# Altium schematic sheet v6_io_23_24_25_26.SchDoc: Virtex-6 IO Banks 23, 24, 25 & 26
size A3; Date: DO NOT USE, RATHER USE PROJ OPTIONS; DrawnBy: DO NOT USE, RATHER USE PROJ OPTIONS; Engineer: DO NOT USE, RATHER USE PROJ OPTIONS; Organization: DO NOT USE, RATHER USE PROJ OPTIONS; DocumentNumber: DO NOT USE, RATHER USE PROJ OPTIONS; Revision: DO NOT USE, RATHER USE PROJ OPTIONS; SheetNumber: 15; SheetTotal: 27; SCH_Sheet_Filename: v6_config_io_23_24_25_26.SchDoc; CurrentTime: DO NOT USE, RATHER USE PROJ OPTIONS; Time: DO NOT USE, RATHER USE PROJ OPTIONS; DocumentFullPathAndName: DO NOT USE, RATHER USE PROJ OPTIONS; DocumentName: DO NOT USE, RATHER USE PROJ OPTIONS; ModifiedDate: DO NOT USE, RATHER USE PROJ OPTIONS; ImagePath: DO NOT USE, RATHER USE PROJ OPTIONS
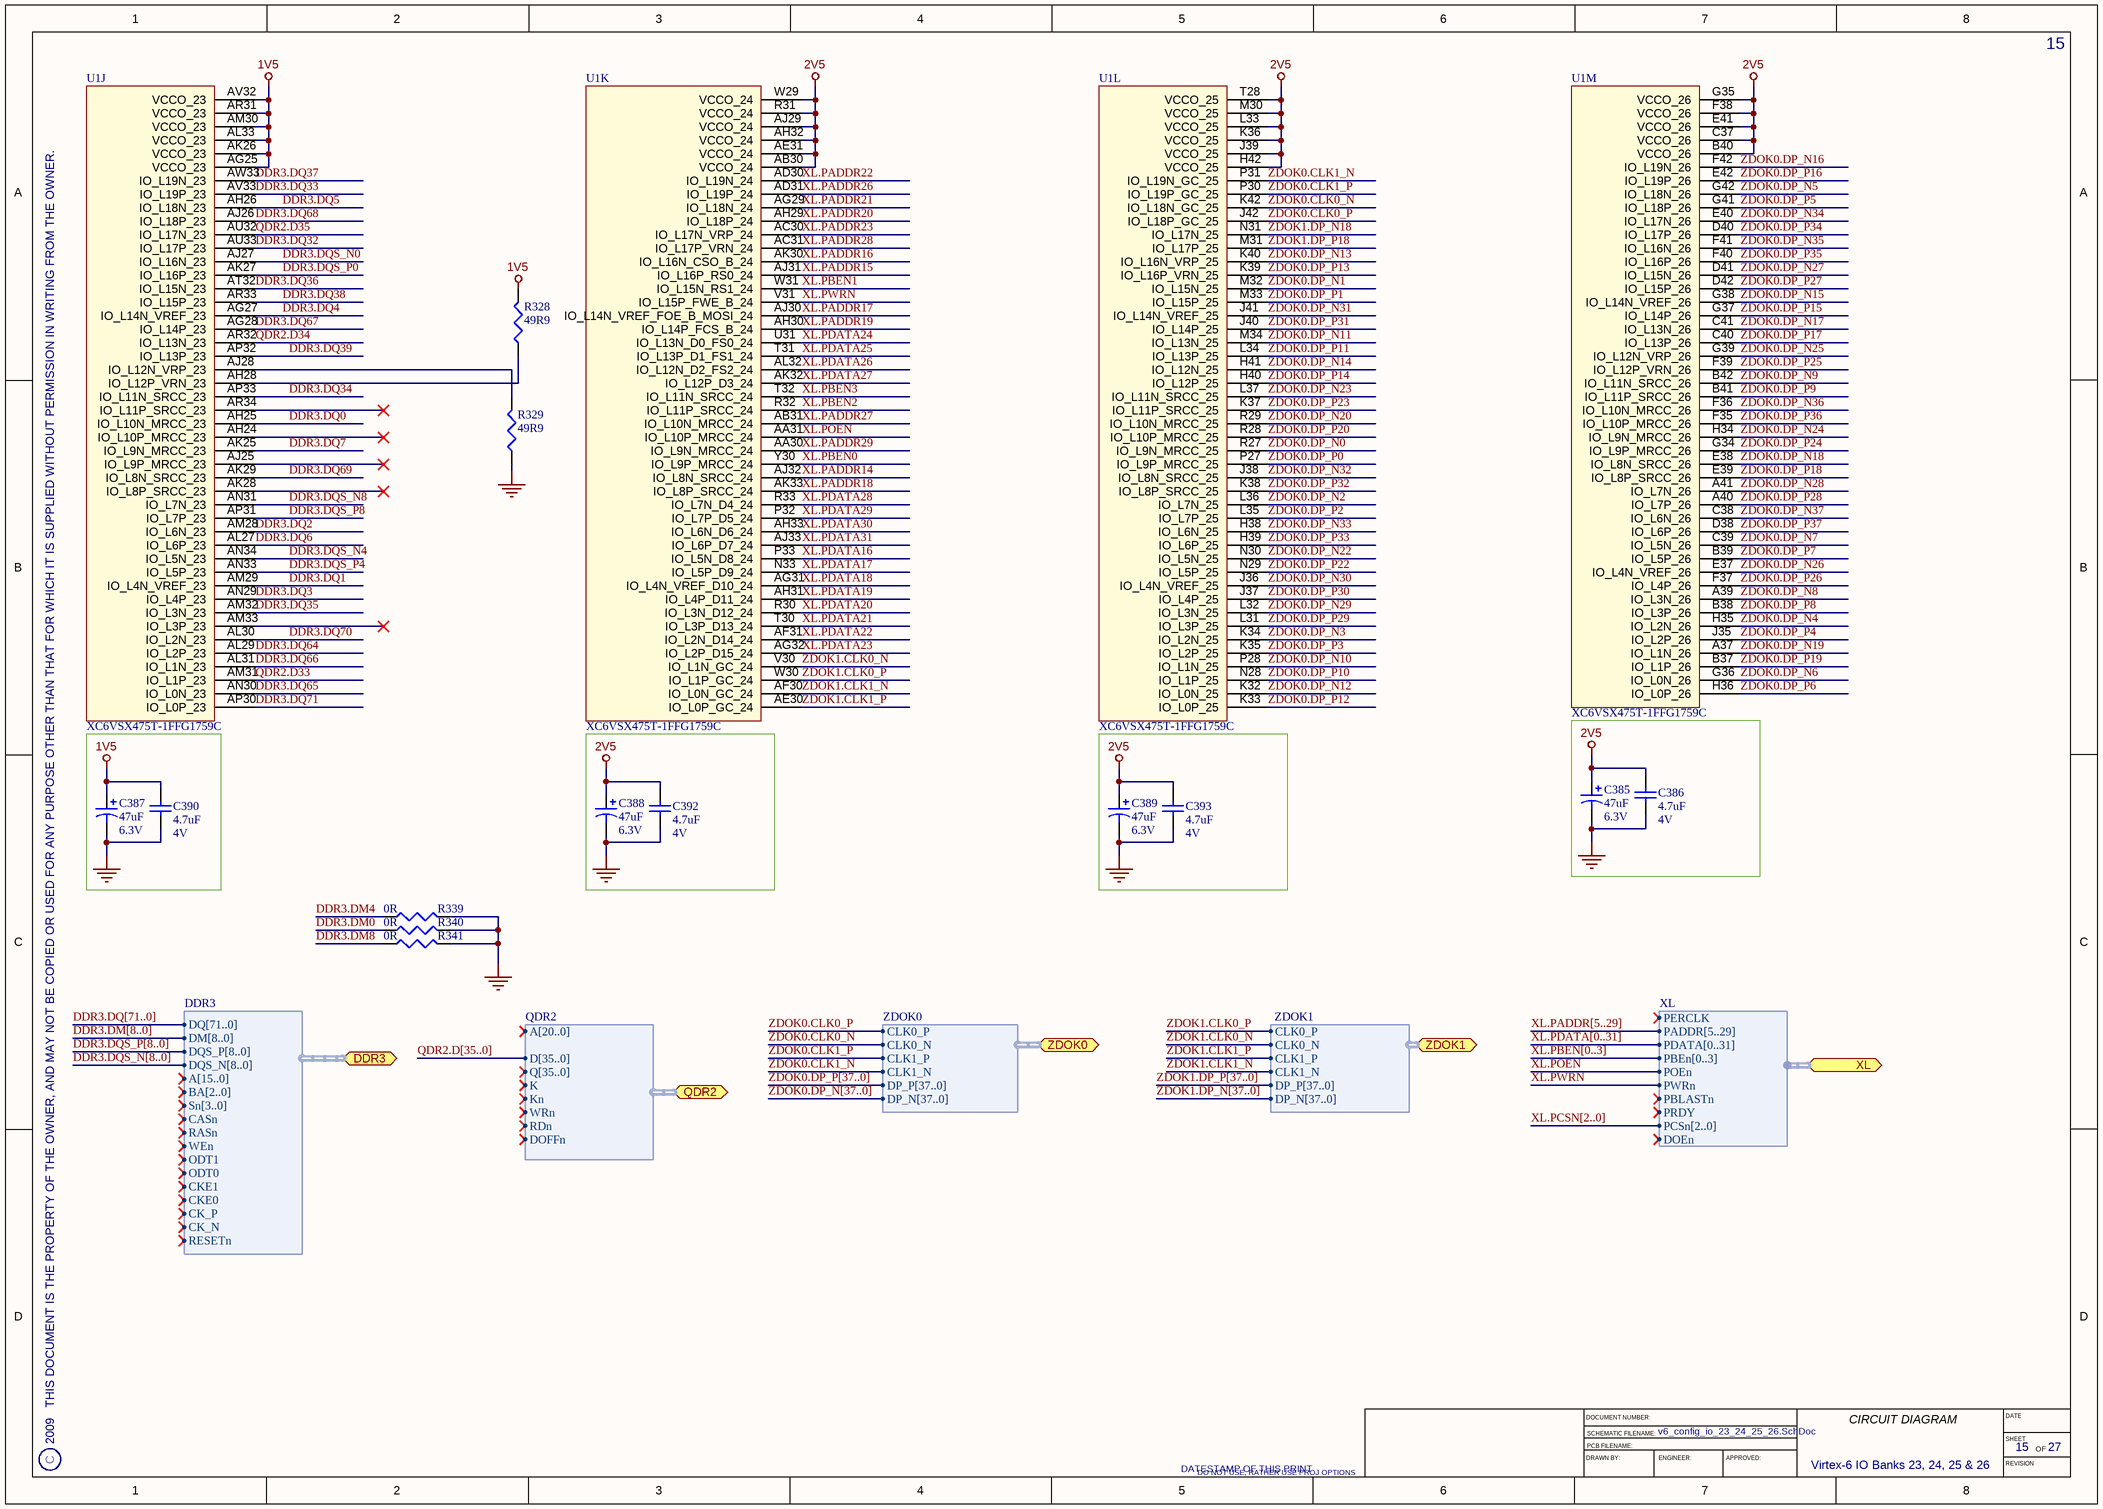
[diagram p0: v6_io_23_24_25_26.SchDoc]

## Parts
C385  Rating: 6.3V  [CAPMP3528X120L]  (hidden comment: 47uF)
C386  Rating: 4V  [CAPC1005X60L]  (hidden comment: 4.7uF)
C387  Rating: 6.3V  [CAPMP3528X120L]  (hidden comment: 47uF)
C388  Rating: 6.3V  [CAPMP3528X120L]  (hidden comment: 47uF)
C389  Rating: 6.3V  [CAPMP3528X120L]  (hidden comment: 47uF)
C390  Rating: 4V  [CAPC1005X60L]  (hidden comment: 4.7uF)
C392  Rating: 4V  [CAPC1005X60L]  (hidden comment: 4.7uF)
C393  Rating: 4V  [CAPC1005X60L]  (hidden comment: 4.7uF)
R328  49R9  [RESC1005X40L]
R329  49R9  [RESC1005X40L]
R339  0R  [RESC1005X40L]
R340  0R  [RESC1005X40L]
R341  0R  [RESC1005X40L]
U1  XC6VSX475T-1FFG1759C  [FFG1759]  (parts J,K,L,M of 39)

## Ports
DDR3 (harness DDR3), QDR2 (harness QDR2), XL (harness XL), ZDOK0 (harness ZDOK0), ZDOK1 (harness ZDOK1)

## Harnesses
ZDOK1: CLK0_P, CLK0_N, CLK1_P, CLK1_N, DP_P[37..0], DP_N[37..0]
QDR2: A[20..0], D[35..0], Q[35..0], K, Kn, WRn, RDn, DOFFn
DDR3: DQ[71..0], DM[8..0], DQS_P[8..0], DQS_N[8..0], A[15..0], BA[2..0], Sn[3..0], CASn, RASn, WEn, ODT1, ODT0, CKE1, CKE0, CK_P, CK_N, RESETn
ZDOK0: CLK0_P, CLK0_N, CLK1_P, CLK1_N, DP_P[37..0], DP_N[37..0]
XL: PERCLK, PADDR[5..29], PDATA[0..31], PBEn[0..3], POEn, PWRn, PBLASTn, PRDY, PCSn[2..0], DOEn

## Nets
1V5: C387.1 C390.2 R328.2 U1.AG25(VCCO_23) U1.AK26(VCCO_23) U1.AL33(VCCO_23) U1.AM30(VCCO_23) U1.AR31(VCCO_23) U1.AV32(VCCO_23)
2V5: C385.1 C386.2 C388.1 C389.1 C392.2 C393.2 U1.AB30(VCCO_24) U1.AE31(VCCO_24) U1.AH32(VCCO_24) U1.AJ29(VCCO_24) U1.B40(VCCO_26) U1.C37(VCCO_26) U1.E41(VCCO_26) U1.F38(VCCO_26) U1.G35(VCCO_26) U1.H42(VCCO_25) U1.J39(VCCO_25) U1.K36(VCCO_25) U1.L33(VCCO_25) U1.M30(VCCO_25) U1.R31(VCCO_24) U1.T28(VCCO_25) U1.W29(VCCO_24)
GND: C385.2 C386.1 C387.2 C388.2 C389.2 C390.1 C392.1 C393.1 R329.1 R339.2 R340.2 R341.2
DDR3.DM0: R340.1
DDR3.DM4: R339.1
DDR3.DM8: R341.1
DDR3.DQ0: U1.AH25(IO_L10N_MRCC_23)
DDR3.DQ1: U1.AM29(IO_L4N_VREF_23)
DDR3.DQ2: U1.AM28(IO_L6N_23)
DDR3.DQ3: U1.AN29(IO_L4P_23)
DDR3.DQ4: U1.AG27(IO_L14N_VREF_23)
DDR3.DQ5: U1.AH26(IO_L18N_23)
DDR3.DQ6: U1.AL27(IO_L6P_23)
DDR3.DQ7: U1.AK25(IO_L9N_MRCC_23)
DDR3.DQ32: U1.AU33(IO_L17P_23)
DDR3.DQ33: U1.AV33(IO_L19P_23)
DDR3.DQ34: U1.AP33(IO_L11N_SRCC_23)
DDR3.DQ35: U1.AM32(IO_L3N_23)
DDR3.DQ36: U1.AT32(IO_L15N_23)
DDR3.DQ37: U1.AW33(IO_L19N_23)
DDR3.DQ38: U1.AR33(IO_L15P_23)
DDR3.DQ39: U1.AP32(IO_L13P_23)
DDR3.DQ64: U1.AL29(IO_L2P_23)
DDR3.DQ65: U1.AN30(IO_L0N_23)
DDR3.DQ66: U1.AL31(IO_L1N_23)
DDR3.DQ67: U1.AG28(IO_L14P_23)
DDR3.DQ68: U1.AJ26(IO_L18P_23)
DDR3.DQ69: U1.AK29(IO_L8N_SRCC_23)
DDR3.DQ70: U1.AL30(IO_L2N_23)
DDR3.DQ71: U1.AP30(IO_L0P_23)
DDR3.DQS_N0: U1.AJ27(IO_L16N_23)
DDR3.DQS_N4: U1.AN34(IO_L5N_23)
DDR3.DQS_N8: U1.AN31(IO_L7N_23)
DDR3.DQS_P0: U1.AK27(IO_L16P_23)
DDR3.DQS_P4: U1.AN33(IO_L5P_23)
DDR3.DQS_P8: U1.AP31(IO_L7P_23)
QDR2.D33: U1.AM31(IO_L1P_23)
QDR2.D34: U1.AR32(IO_L13N_23)
QDR2.D35: U1.AU32(IO_L17N_23)
XL.PADDR14: U1.AJ32(IO_L8N_SRCC_24)
XL.PADDR15: U1.AJ31(IO_L16P_RS0_24)
XL.PADDR16: U1.AK30(IO_L16N_CSO_B_24)
XL.PADDR17: U1.AJ30(IO_L14N_VREF_FOE_B_MOSI_24)
XL.PADDR18: U1.AK33(IO_L8P_SRCC_24)
XL.PADDR19: U1.AH30(IO_L14P_FCS_B_24)
XL.PADDR20: U1.AH29(IO_L18P_24)
XL.PADDR21: U1.AG29(IO_L18N_24)
XL.PADDR22: U1.AD30(IO_L19N_24)
XL.PADDR23: U1.AC30(IO_L17N_VRP_24)
XL.PADDR26: U1.AD31(IO_L19P_24)
XL.PADDR27: U1.AB31(IO_L10N_MRCC_24)
XL.PADDR28: U1.AC31(IO_L17P_VRN_24)
XL.PADDR29: U1.AA30(IO_L9N_MRCC_24)
XL.PBEN0: U1.Y30(IO_L9P_MRCC_24)
XL.PBEN1: U1.W31(IO_L15N_RS1_24)
XL.PBEN2: U1.R32(IO_L11P_SRCC_24)
XL.PBEN3: U1.T32(IO_L11N_SRCC_24)
XL.PDATA16: U1.P33(IO_L5N_D8_24)
XL.PDATA17: U1.N33(IO_L5P_D9_24)
XL.PDATA18: U1.AG31(IO_L4N_VREF_D10_24)
XL.PDATA19: U1.AH31(IO_L4P_D11_24)
XL.PDATA20: U1.R30(IO_L3N_D12_24)
XL.PDATA21: U1.T30(IO_L3P_D13_24)
XL.PDATA22: U1.AF31(IO_L2N_D14_24)
XL.PDATA23: U1.AG32(IO_L2P_D15_24)
XL.PDATA24: U1.U31(IO_L13N_D0_FS0_24)
XL.PDATA25: U1.T31(IO_L13P_D1_FS1_24)
XL.PDATA26: U1.AL32(IO_L12N_D2_FS2_24)
XL.PDATA27: U1.AK32(IO_L12P_D3_24)
XL.PDATA28: U1.R33(IO_L7N_D4_24)
XL.PDATA29: U1.P32(IO_L7P_D5_24)
XL.PDATA30: U1.AH33(IO_L6N_D6_24)
XL.PDATA31: U1.AJ33(IO_L6P_D7_24)
XL.POEN: U1.AA31(IO_L10P_MRCC_24) ; port XL.POEn
XL.PWRN: U1.V31(IO_L15P_FWE_B_24) ; port XL.PWRn
ZDOK0.CLK0_N: U1.K42(IO_L18N_GC_25) ; port ZDOK0.CLK0_N
ZDOK0.CLK0_P: U1.J42(IO_L18P_GC_25) ; port ZDOK0.CLK0_P
ZDOK0.CLK1_N: U1.P31(IO_L19N_GC_25) ; port ZDOK0.CLK1_N
ZDOK0.CLK1_P: U1.P30(IO_L19P_GC_25) ; port ZDOK0.CLK1_P
ZDOK0.DP_N0: U1.R27(IO_L9N_MRCC_25)
ZDOK0.DP_N1: U1.M32(IO_L15N_25)
ZDOK0.DP_N2: U1.L36(IO_L7N_25)
ZDOK0.DP_N3: U1.K34(IO_L2N_25)
ZDOK0.DP_N4: U1.H35(IO_L2N_26)
ZDOK0.DP_N5: U1.G42(IO_L18N_26)
ZDOK0.DP_N6: U1.G36(IO_L0N_26)
ZDOK0.DP_N7: U1.C39(IO_L5N_26)
ZDOK0.DP_N8: U1.A39(IO_L3N_26)
ZDOK0.DP_N9: U1.B42(IO_L11N_SRCC_26)
ZDOK0.DP_N10: U1.P28(IO_L1N_25)
ZDOK0.DP_N11: U1.M34(IO_L13N_25)
ZDOK0.DP_N12: U1.K32(IO_L0N_25)
ZDOK0.DP_N13: U1.K40(IO_L16N_VRP_25)
ZDOK0.DP_N14: U1.H41(IO_L12N_25)
ZDOK0.DP_N15: U1.G38(IO_L14N_VREF_26)
ZDOK0.DP_N16: U1.F42(IO_L19N_26)
ZDOK0.DP_N17: U1.C41(IO_L13N_26)
ZDOK0.DP_N18: U1.E38(IO_L8N_SRCC_26)
ZDOK0.DP_N19: U1.A37(IO_L1N_26)
ZDOK0.DP_N20: U1.R29(IO_L10N_MRCC_25)
ZDOK0.DP_N22: U1.N30(IO_L5N_25)
ZDOK0.DP_N23: U1.L37(IO_L11N_SRCC_25)
ZDOK0.DP_N24: U1.H34(IO_L9N_MRCC_26)
ZDOK0.DP_N25: U1.G39(IO_L12N_VRP_26)
ZDOK0.DP_N26: U1.E37(IO_L4N_VREF_26)
ZDOK0.DP_N27: U1.D41(IO_L15N_26)
ZDOK0.DP_N28: U1.A41(IO_L7N_26)
ZDOK0.DP_N29: U1.L32(IO_L3N_25)
ZDOK0.DP_N30: U1.J36(IO_L4N_VREF_25)
ZDOK0.DP_N31: U1.J41(IO_L14N_VREF_25)
ZDOK0.DP_N32: U1.J38(IO_L8N_SRCC_25)
ZDOK0.DP_N33: U1.H38(IO_L6N_25)
ZDOK0.DP_N34: U1.E40(IO_L17N_26)
ZDOK0.DP_N35: U1.F41(IO_L16N_26)
ZDOK0.DP_N36: U1.F36(IO_L10N_MRCC_26)
ZDOK0.DP_N37: U1.C38(IO_L6N_26)
ZDOK0.DP_P0: U1.P27(IO_L9P_MRCC_25)
ZDOK0.DP_P1: U1.M33(IO_L15P_25)
ZDOK0.DP_P2: U1.L35(IO_L7P_25)
ZDOK0.DP_P3: U1.K35(IO_L2P_25)
ZDOK0.DP_P4: U1.J35(IO_L2P_26)
ZDOK0.DP_P5: U1.G41(IO_L18P_26)
ZDOK0.DP_P6: U1.H36(IO_L0P_26)
ZDOK0.DP_P7: U1.B39(IO_L5P_26)
ZDOK0.DP_P8: U1.B38(IO_L3P_26)
ZDOK0.DP_P9: U1.B41(IO_L11P_SRCC_26)
ZDOK0.DP_P10: U1.N28(IO_L1P_25)
ZDOK0.DP_P11: U1.L34(IO_L13P_25)
ZDOK0.DP_P12: U1.K33(IO_L0P_25)
ZDOK0.DP_P13: U1.K39(IO_L16P_VRN_25)
ZDOK0.DP_P14: U1.H40(IO_L12P_25)
ZDOK0.DP_P15: U1.G37(IO_L14P_26)
ZDOK0.DP_P16: U1.E42(IO_L19P_26)
ZDOK0.DP_P17: U1.C40(IO_L13P_26)
ZDOK0.DP_P18: U1.E39(IO_L8P_SRCC_26)
ZDOK0.DP_P19: U1.B37(IO_L1P_26)
ZDOK0.DP_P20: U1.R28(IO_L10P_MRCC_25)
ZDOK0.DP_P22: U1.N29(IO_L5P_25)
ZDOK0.DP_P23: U1.K37(IO_L11P_SRCC_25)
ZDOK0.DP_P24: U1.G34(IO_L9P_MRCC_26)
ZDOK0.DP_P25: U1.F39(IO_L12P_VRN_26)
ZDOK0.DP_P26: U1.F37(IO_L4P_26)
ZDOK0.DP_P27: U1.D42(IO_L15P_26)
ZDOK0.DP_P28: U1.A40(IO_L7P_26)
ZDOK0.DP_P29: U1.L31(IO_L3P_25)
ZDOK0.DP_P30: U1.J37(IO_L4P_25)
ZDOK0.DP_P31: U1.J40(IO_L14P_25)
ZDOK0.DP_P32: U1.K38(IO_L8P_SRCC_25)
ZDOK0.DP_P33: U1.H39(IO_L6P_25)
ZDOK0.DP_P34: U1.D40(IO_L17P_26)
ZDOK0.DP_P35: U1.F40(IO_L16P_26)
ZDOK0.DP_P36: U1.F35(IO_L10P_MRCC_26)
ZDOK0.DP_P37: U1.D38(IO_L6P_26)
ZDOK1.CLK0_N: U1.V30(IO_L1N_GC_24) ; port ZDOK1.CLK0_N
ZDOK1.CLK0_P: U1.W30(IO_L1P_GC_24) ; port ZDOK1.CLK0_P
ZDOK1.CLK1_N: U1.AF30(IO_L0N_GC_24) ; port ZDOK1.CLK1_N
ZDOK1.CLK1_P: U1.AE30(IO_L0P_GC_24) ; port ZDOK1.CLK1_P
ZDOK1.DP_N18: U1.N31(IO_L17N_25)
ZDOK1.DP_P18: U1.M31(IO_L17P_25)
NetR328_1: R328.1 U1.AH28(IO_L12P_VRN_23)
NetR329_2: R329.2 U1.AJ28(IO_L12N_VRP_23)

Not connected (* = marked no-connect by the designer): U1 AH24(IO_L10P_MRCC_23)* AJ25(IO_L9P_MRCC_23)* AK28(IO_L8P_SRCC_23)* AM33(IO_L3P_23)* AR34(IO_L11P_SRCC_23)*

## Buses and harness runs
bus DDR3.DM[8..0]
bus DDR3.DQ[71..0]
bus DDR3.DQS_N[8..0]
bus DDR3.DQS_P[8..0]
bus QDR2.D[35..0]
bus XL.PADDR[5..29]
bus XL.PBEN[0..3]
bus XL.PCSN[2..0]
bus XL.PDATA[0..31]
bus ZDOK0.DP_N[37..0]
bus ZDOK0.DP_P[37..0]
bus ZDOK1.DP_N[37..0]
bus ZDOK1.DP_P[37..0]

## Notes on the sheet
- 2009   THIS DOCUMENT IS THE PROPERTY OF THE OWNER, AND MAY NOT BE COPIED OR USED FOR ANY PURPOSE OTHER THAN THAT FOR WHICH IT IS SUPPLIED WITHOUT PERMISSION IN WRITING FROM THE OWNER.
- C
- DATESTAMP OF THIS PRINT
- DRAWN BY:
- DOCUMENT NUMBER:
- SCHEMATIC FILENAME:
- PCB FILENAME:
- ENGINEER:
- APPROVED:
- CIRCUIT DIAGRAM
- DATE
- SHEET
- REVISION
- OF

## Library data of the parts
C385 C387-C389 = CAP-TAN-1: 47uF, Conductive Polymer Chip Capacitor; Manufacturer: KEMET; PartNum: T520T476M006ATE070; Tolerance: 20%; ESR: 0.07; POD number: CAP-TAN-1; Value: 47uF; RoHS: Y; Sort Value: 47; Category: Capacitors; Subcategory: Tantalum
C386 C390 C392 C393 = CAP-CER-11: 4.7uF, Ceramic Capacitor; Manufacturer: MURATA; PartNum: AMK105BJ475MV-F; Tolerance: 20%; Dielectric: X5R; POD number: CAP-CER-11; Value: 4.7uF; RoHS: Y; Sort Value: 4.7; Category: Capacitors; Subcategory: Ceramic
R328 R329 = RES-TF-10: 49R9, 1.1mm x 0.5mm, Thick Film Resistor; Manufacturer: ROYALOHM; PartNum: 0402WGF499JT1E; Tolerance: 1%; Rating: 0.0625W; POD number: RES-TF-10; Value: 49R9; Sort Value: 49.9; Category: Resistors; Subcategory: ThickFilm; HelpURL: *.pdf
R339-R341 = RES-TF-0: 0R, 1.1mm x 0.5mm, Thick Film Resistor; Manufacturer: ROYALOHM; PartNum: 0402WG00000T1E; Tolerance: 0%; Rating: 0.0625W; POD number: RES-TF-0; Value: 0R; Sort Value: 0; Category: Resistors; Subcategory: ThickFilm; HelpURL: *.pdf
U1 = IC-PLD-0: Virtex-6 475SXT 1760-pin FPGA; Manufacturer: Xilinx; POD number: IC-PLD-0; PartNum: XC6VSX475T-1FFG1759C; RoHS: Y; Category: IC; Subcategory: PLD